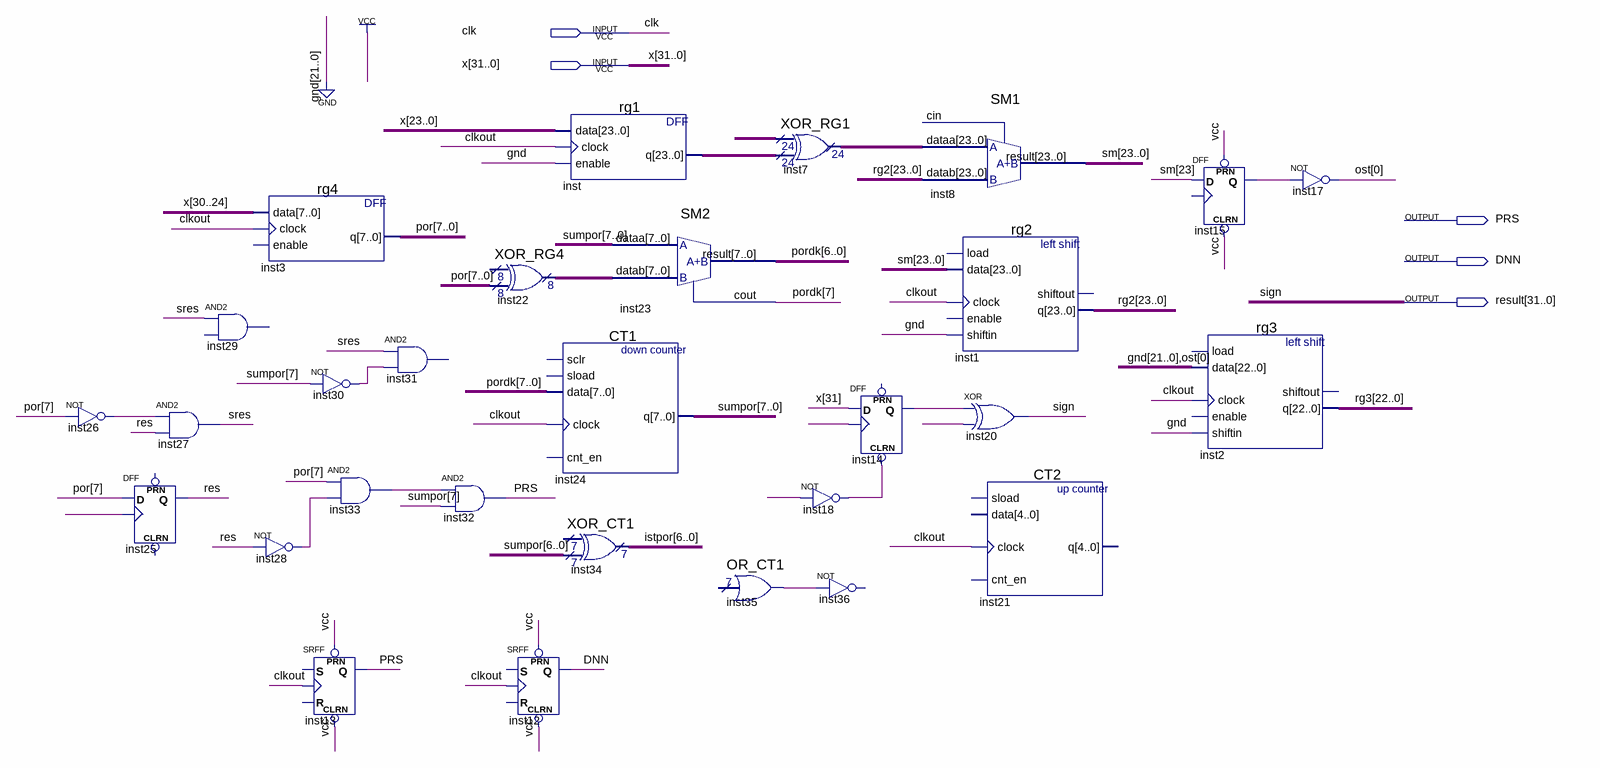
[diagram p0: schematic sheet]
// Quartus schematic Delenie.bdf as structural Verilog: 29 symbols, 5 pins
module Delenie (
  input  clk,
  input  [31:0] x,
  output PRS,
  output DNN,
  output [31:0] result
);

  wire clkout, gnd, inst14_q, inst15_q, inst18_out, inst26_out, inst28_out, inst30_out, inst33_out,
       inst35_result, res, sign, sres, undriven_2, undriven_3, undriven_4, undriven_5, vcc;
  wire [0:0] ost;
  wire [6:0] istpor;
  wire [7:0] inst22_result, por, pordk, sumpor;
  wire [22:0] rg3;
  wire [23:0] inst7_result, inst_q, rg2, sm, undriven;

  not inst26 (inst26_out, por[7]);
  DFF inst25 (.CLK(undriven_5), .D(por[7]), .Q(res));  // open: CLRN, PRN
  // AND2 inst29 has open pins: IN1=sres, IN2=open, OUT=open
  and inst27 (sres, inst26_out, res);
  rg4 inst3 (.data(x[30:24]), .clock(clkout), .q(por));  // open: enable
  not inst28 (inst28_out, res);
  not inst30 (inst30_out, sumpor[7]);
  and inst33 (inst33_out, por[7], inst28_out);
  SRFF inst13 (.PRN(vcc), .CLRN(vcc), .CLK(clkout), .Q(PRS));  // open: S, R
  // AND2 inst31 has open pins: IN1=sres, IN2=inst30_out, OUT=open
  and inst32 (PRS, inst33_out, sumpor[7]);
  XOR_RG4 inst22 (.data1x(por), .result(inst22_result));  // open: data0x
  SRFF inst12 (.PRN(vcc), .CLRN(vcc), .CLK(clkout), .Q(DNN));  // open: S, R
  rg1 inst (.data(x[23:0]), .clock(clkout), .enable(gnd), .q(inst_q));
  CT1 inst24 (.data(pordk), .clock(clkout), .q(sumpor));  // open: sclr, sload, cnt_en
  XOR_CT1 inst34 (.data1x(sumpor[6:0]), .result(istpor));  // open: data0x
  SM2 inst23 (.dataa(sumpor), .datab(inst22_result), .result(pordk[6:0]), .cout(pordk[7]));
  OR_CT1 inst35 (.result(inst35_result));  // open: data
  XOR_RG1 inst7 (.data0x(undriven), .data1x(inst_q), .result(inst7_result));
  DFF inst14 (.CLRN(inst18_out), .CLK(undriven_3), .D(x[31]), .Q(inst14_q));  // open: PRN
  not inst18 (inst18_out, undriven_2);
  // NOT inst36 has open pins: IN=inst35_result, OUT=open
  SM1 inst8 (.dataa(inst7_result), .datab(rg2), .result(sm));  // open: cin
  rg2 inst1 (.data(sm), .clock(clkout), .shiftin(gnd), .q(rg2));  // open: load, enable, shiftout
  xor inst20 (sign, inst14_q, undriven_4);
  CT2 inst21 (.clock(clkout));  // open: sload, data, cnt_en, q
  DFF inst15 (.CLRN(vcc), .D(sm[23]), .PRN(vcc), .Q(inst15_q));  // open: CLK
  rg3 inst2 (.data({{22{1'b0}}, ost[0]}), .clock(clkout), .shiftin(gnd), .q(rg3));  // open: load, enable, shiftout
  not inst17 (ost[0], inst15_q);
endmodule
